# EAGLE design microbit-arduino (EAGLE 9.2.0)
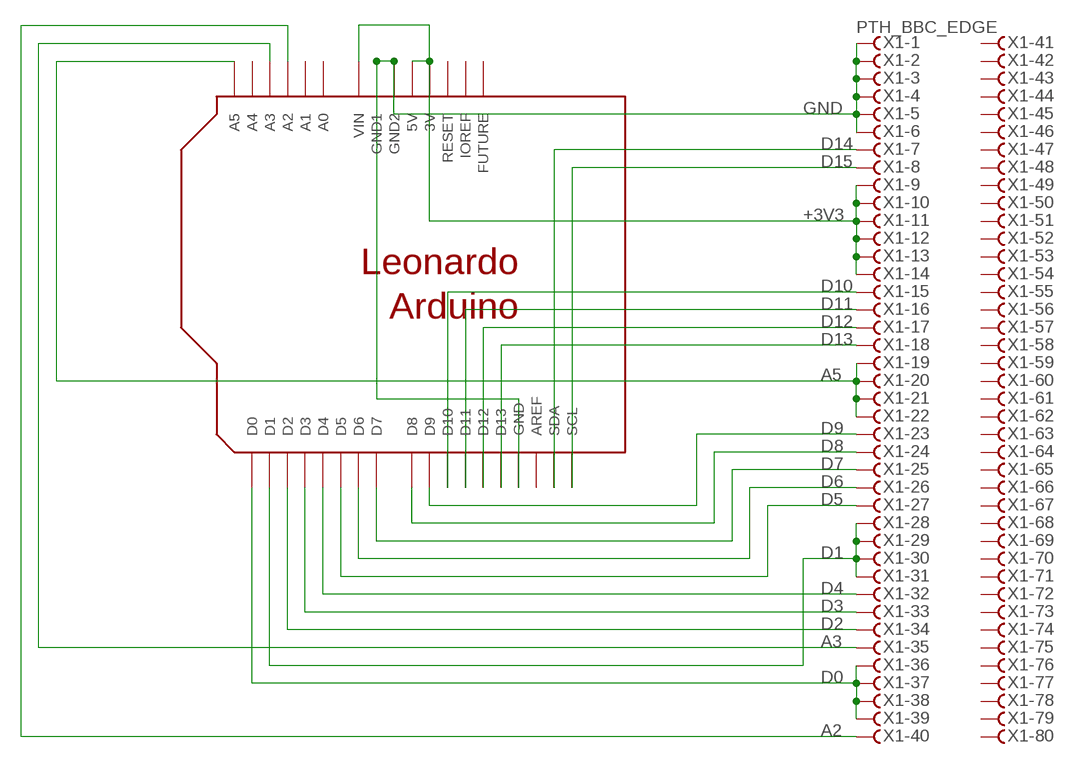
[diagram p0: schematic, sheet 1]

## Parts
U$1  ARDUINO_LEONARDO  [ARDUINO_LEONARDO]
X1  PTH_BBC_EDGE  [PTH_BBC_EDGE]

## Nets
+3V3: U$1.3V U$1.5V U$1.VIN X1.9 X1.10 X1.11 X1.12 X1.13 X1.14
A2: U$1.A2 X1.40
A3: U$1.A3 X1.35
A5: U$1.A5 X1.19 X1.20 X1.21 X1.22
D0: U$1.D0 X1.36 X1.37 X1.38 X1.39
D1: U$1.D1 X1.28 X1.29 X1.30 X1.31
D2: U$1.D2 X1.34
D3: U$1.D3 X1.33
D4: U$1.D4 X1.32
D5: U$1.D5 X1.27
D6: U$1.D6 X1.26
D7: U$1.D7 X1.25
D8: U$1.D8 X1.24
D9: U$1.D9 X1.23
D10: U$1.D10 X1.15
D11: U$1.D11 X1.16
D12: U$1.D12 X1.17
D13: U$1.D13 X1.18
D14: U$1.SDA X1.7
D15: U$1.SCL X1.8
GND: U$1.GND U$1.GND$2(GND2) U$1.GND$3(GND1) X1.1 X1.2 X1.3 X1.4 X1.5 X1.6
Unconnected: U$1.A0 U$1.A1 U$1.A4 U$1.AREF U$1.IOREF U$1.RESERVED(FUTURE) U$1.RESET X1.41 X1.42 X1.43 X1.44 X1.45 X1.46 X1.47 X1.48 X1.49 X1.50 X1.51 X1.52 X1.53 X1.54 X1.55 X1.56 X1.57 X1.58 X1.59 X1.60 X1.61 X1.62 X1.63 X1.64 X1.65 X1.66 X1.67 X1.68 X1.69 X1.70 X1.71 X1.72 X1.73 X1.74 X1.75 X1.76 X1.77 X1.78 X1.79 X1.80

## Library data of the parts
U$1 = srg:ARDUINO_LEONARDO: Arduino Leonardo I2C Pins: D2, D3 PWM Pins: D3, D5, D5, D11, D13 Interrup Pint: D2, D3 http://arduino.cc/en/Main/arduinoBoardLeonardo
X1 = microbit:PTH_BBC_EDGE: TE CONNECTIVITY / AMP - BUCHSE, SCSI, VERTIKAL, 80 Source: Data sheet <http://www.tycoelectronics.com/commerce/DocumentDelivery/DDEController?Action=srchrtrv&DocNm=5749069&DocType=Customer+Drawing&DocLang=English>

## Board
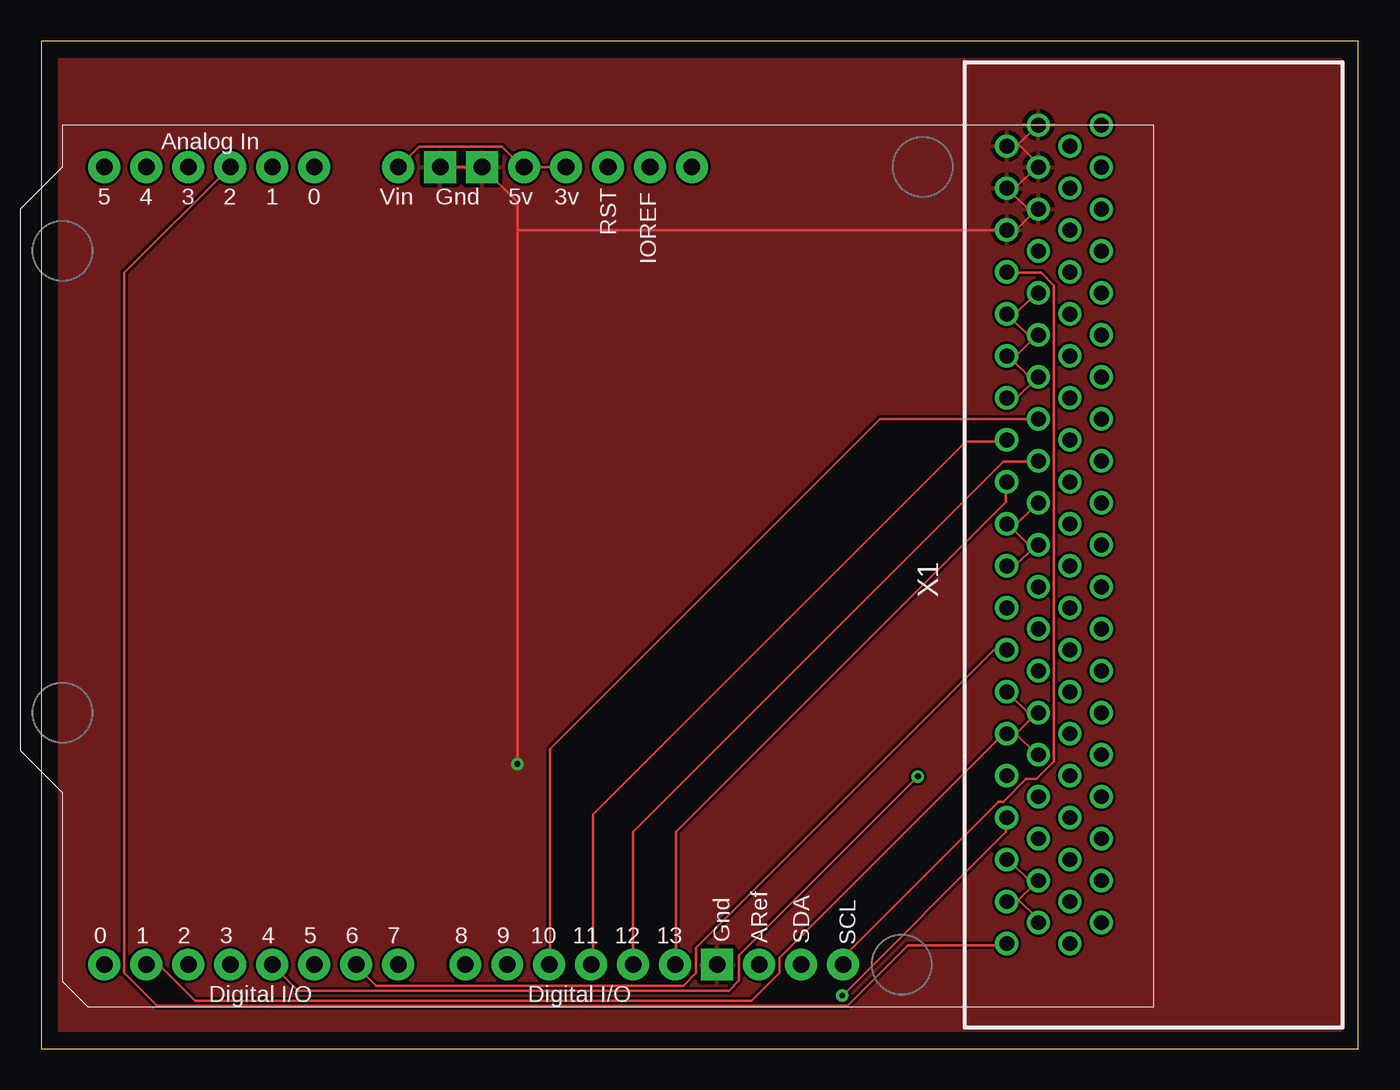
[diagram p1: board, top side]
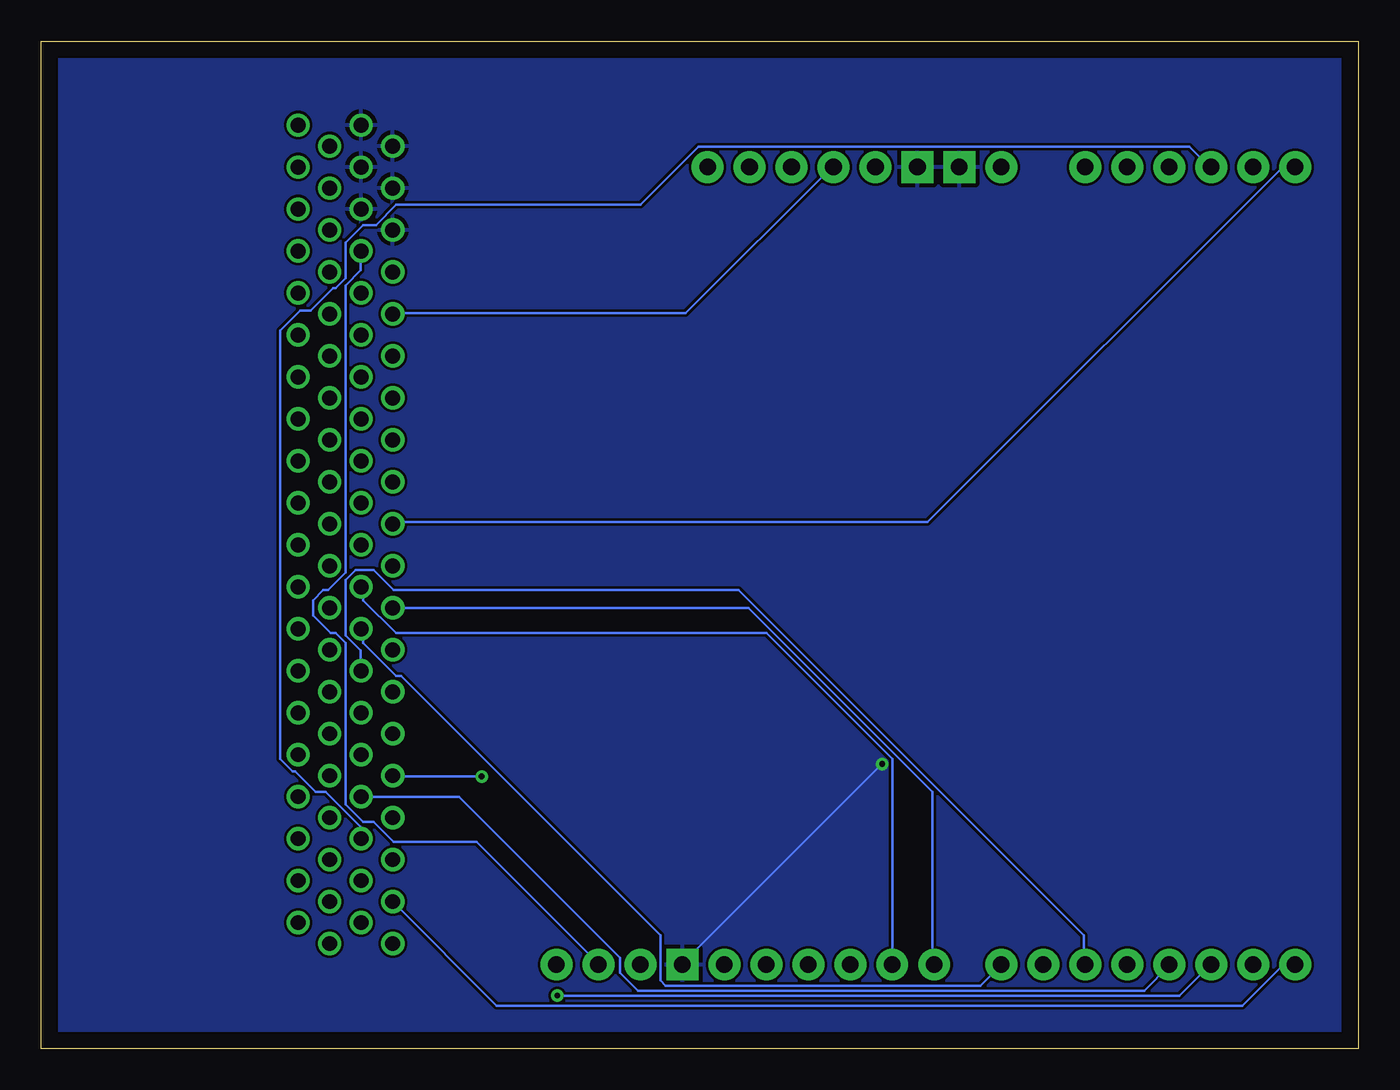
[diagram p2: board, bottom side, seen from below]

Size 79.68 x 60.95 mm. Coordinates in mm from the lower left corner, seen from the top.
Outline: 0,0 79.68,0 79.68,60.95 0,60.95 0,0
Copper layers (1*16): Top 0.035mm / dielectric 1.5mm / Bottom 0.035mm
Design rules "default": minimum track width 6mil, minimum drill 0.35mm, track to track 6mil, track to pad 6mil, pad to pad 6mil, via to via 6mil, smd to smd 6mil, copper to edge 40mil, drill to drill 6mil, minimum pad ring 10mil, minimum via ring 8mil, stop-mask expansion 4mil, vias tented up to drill 0mil, thermal gap 10mil

### Footprints (pad centres in the part's own frame; a part is rotated, then mirrored left to right if it is on the bottom)
ARDUINO_LEONARDO = drill 1 pad 1.93: 3V 1.27,-24.13; 5V 3.81,-24.13; A0 16.51,-24.13; A1 19.05,-24.13; A2 21.59,-24.13; A3 24.13,-24.13; A4 26.67,-24.13; A5 29.21,-24.13; AREF -10.414,24.13; D0 29.21,24.13; D1 26.67,24.13; D2 24.13,24.13; D3 21.59,24.13; D4 19.05,24.13; D5 16.51,24.13; D6 13.97,24.13; D7 11.43,24.13; D8 7.366,24.13; D9 4.826,24.13; D10 2.286,24.13; D11 -0.254,24.13; D12 -2.794,24.13; D13 -5.334,24.13; IOREF -3.81,-24.13; RESERVED -6.35,-24.13; RESET -1.27,-24.13; SCL -15.494,24.13; SDA -12.954,24.13; VIN 11.43,-24.13 | drill 1 pad 1.93 square: GND -7.874,24.13; GND$2 8.89,-24.13; GND$3 6.35,-24.13
PTH_BBC_EDGE = drill 0.9 pad 1.27: 1 49.53,-1.905; 2 48.26,0.005; 3 46.99,-1.905; 4 45.72,0.005; 5 44.45,-1.905; 6 43.18,0.005; 7 41.91,-1.905; 8 40.64,0.005; 9 39.37,-1.905; 10 38.1,0.005; 11 36.83,-1.905; 12 35.56,0.005; 13 34.29,-1.905; 14 33.02,0.005; 15 31.75,-1.905; 16 30.48,0.005; 17 29.21,-1.905; 18 27.94,0.005; 19 26.67,-1.905; 20 25.4,0.005; 21 24.13,-1.905; 22 22.86,0.005; 23 21.59,-1.905; 24 20.32,0.005; 25 19.05,-1.905; 26 17.78,0.005; 27 16.51,-1.905; 28 15.24,0.005; 29 13.97,-1.905; 30 12.7,0.005; 31 11.43,-1.905; 32 10.16,0.005; 33 8.89,-1.905; 34 7.62,0.005; 35 6.35,-1.905; 36 5.08,0.005; 37 3.81,-1.905; 38 2.54,0.005; 39 1.27,-1.905; 40 0,0.005; 41 49.53,-5.724; 42 48.26,-3.814; 43 46.99,-5.724; 44 45.72,-3.814; 45 44.45,-5.724; 46 43.18,-3.814; 47 41.91,-5.724; 48 40.64,-3.814; 49 39.37,-5.724; 50 38.1,-3.814; 51 36.83,-5.724; 52 35.56,-3.814; 53 34.29,-5.724; 54 33.02,-3.814; 55 31.75,-5.724; 56 30.48,-3.814; 57 29.21,-5.724; 58 27.94,-3.814; 59 26.67,-5.724; 60 25.4,-3.814; 61 24.13,-5.724; 62 22.86,-3.814; 63 21.59,-5.724; 64 20.32,-3.814; 65 19.05,-5.724; 66 17.78,-3.814; 67 16.51,-5.724; 68 15.24,-3.814; 69 13.97,-5.724; 70 12.7,-3.814; 71 11.43,-5.724; 72 10.16,-3.814; 73 8.89,-5.724; 74 7.62,-3.814; 75 6.35,-5.724; 76 5.08,-3.814; 77 3.81,-5.724; 78 2.54,-3.814; 79 1.27,-5.724; 80 0,-3.814

### Placement (x,y rotation side)
U$1  33.02,29.21 180 top
X1  58.42,6.35 90 top

### Tracks (layer width: path | path; a pad name or v marks a point on that pad's centre or on a via)
+3V3
  Top 0.152: 60.05,40.39 60.2,40.54 X1.13 60.05,40.39 | 60.05,40.39 59.13,39.47 58.52,39.47 X1.14 | 60.05,40.39 58.67,41.76 | 58.67,41.76 58.52,41.91 X1.12 58.67,41.76 | 60.05,42.98 58.83,41.76 58.67,41.76 | 60.05,42.98 60.2,43.13 X1.11 60.05,42.98 | 58.67,44.2 59.89,42.98 60.05,42.98 | 58.67,44.2 58.52,44.35 X1.10 58.67,44.2 | 58.67,44.2 60.2,45.72 X1.9 | U$1.VIN 21.64,53.34 22.86,54.56 27.89,54.56 29.11,53.34 U$1.5V U$1.3V
  Bottom 0.152: X1.10 58.37,44.5 40.69,44.5 31.85,53.34 U$1.3V
A2
  Top 0.152: U$1.A2 5.03,46.94 5.03,4.57 7.01,2.59 48.77,2.59 52.43,6.25 58.37,6.25 X1.40
A3
  Bottom 0.152: X1.35 60.35,12.8 60.35,13.41 62.48,15.54 63.09,15.54 64.31,16.76 64.47,16.76 65.23,17.53 65.23,43.43 64.01,44.65 63.4,44.65 62.03,46.02 61.87,46.02 61.27,46.63 61.27,48.77 60.2,49.84 59.44,49.84 58.22,51.05 43.43,51.05 39.93,54.56 10.21,54.56 8.99,53.34 U$1.A3
A5
  Top 0.152: 60.05,30.33 60.2,30.48 X1.21 60.05,30.33 | 60.05,30.33 58.98,29.26 58.52,29.26 X1.22 | 58.67,31.55 59.89,30.33 60.05,30.33 | 58.67,31.55 58.52,31.7 X1.20 58.67,31.55 | 58.67,31.55 58.83,31.55 60.2,32.92 X1.19
  Bottom 0.152: U$1.A5 4.57,53.34 26.06,31.85 58.37,31.85 X1.20
D0
  Top 0.152: 59.13,8.99 58.52,8.99 X1.38 | 60.05,9.91 60.2,10.06 X1.37 60.05,9.91 | 60.05,9.91 59.13,8.99 | 59.13,8.99 60.2,7.92 60.2,7.62 X1.39 | 60.05,9.91 58.52,11.43 X1.36
  Bottom 0.152: U$1.D0 3.81,5.03 4.57,5.03 7.01,2.59 52.12,2.59 58.37,8.84 X1.38
D1
  Top 0.152: 58.98,19.05 X1.30 | 60.05,20.12 60.2,20.27 X1.29 60.05,20.12 | 60.05,20.12 58.98,19.05 | 60.05,20.12 59.89,20.12 58.52,21.49 X1.28 | 58.98,19.05 60.2,17.83 X1.31 | 58.52,19.05 X1.30 | X1.30 58.22,19.05 44.65,5.49 44.65,4.57 42.98,2.9 9.3,2.9 7.16,5.03 6.4,5.03 U$1.D1
D2  (via drill 0.35)
  Top 0.152: v48.46,3.2 58.37,13.11 58.37,13.87 X1.34
  Bottom 0.152: v48.46,3.2 10.82,3.2 8.99,5.03 U$1.D2
D3
  Bottom 0.152: X1.33 54.41,15.24 44.65,5.49 44.65,4.57 43.59,3.5 12.95,3.5 11.43,5.03 U$1.D3
D4  (via drill 0.35)
  Top 0.152: v53.03,16.46 42.22,5.64 42.22,4.12 41.6,3.5 15.54,3.5 U$1.D4
  Bottom 0.152: v53.03,16.46 58.37,16.46 X1.32
D5
  Bottom 0.152: X1.27 60.35,22.86 60.35,24.08 61.27,24.99 61.27,28.35 60.66,28.96 59.59,28.96 58.37,27.74 37.49,27.74 16.61,6.86 16.61,5.18 U$1.D5
D6
  Top 0.152: X1.26 58.37,24.08 57.61,24.08 39.62,6.1 39.62,4.57 38.86,3.81 20.27,3.81 19.05,5.03 U$1.D6
D7
  Bottom 0.152: U$1.D7 22.86,3.81 41.91,3.81 42.22,4.12 42.22,6.86 57.91,22.55 58.22,22.55 60.2,24.54 60.2,25.3 X1.25
D8
  Bottom 0.152: X1.24 36.88,26.67 25.76,15.54 25.76,5.18 U$1.D8
D9
  Bottom 0.152: U$1.D9 28.19,17.53 35.81,25.15 58.22,25.15 60.2,27.13 60.2,27.89 X1.23
D10
  Top 0.152: X1.15 50.75,38.1 30.79,18.14 30.79,5.18 U$1.D10
D11
  Top 0.152: X1.16 58.37,36.73 55.93,36.73 33.38,14.17 33.38,5.18 U$1.D11
D12
  Top 0.152: U$1.D12 35.81,13.11 58.22,35.51 60.2,35.51 X1.17
D13
  Top 0.152: X1.18 58.37,34.29 58.37,33.07 38.41,13.11 38.41,5.18 U$1.D13
D14
  Bottom 0.152: X1.7 60.35,48.16 60.35,47.09 61.27,46.18 61.27,28.8 62.33,27.74 62.64,27.74 63.25,27.13 63.25,26.21 62.18,25.15 61.87,25.15 61.27,24.54 61.27,14.78 60.2,13.72 59.59,13.72 58.37,12.5 53.34,12.5 46.02,5.18 U$1.SDA
D15
  Top 0.152: X1.8 58.52,46.94 60.5,46.94 61.27,46.18 61.27,17.37 60.2,16.31 59.59,16.31 58.22,14.94 57.91,14.94 48.62,5.64 48.62,5.18 U$1.SCL
GND  (via drill 0.35)
  Top 0.152: 60.05,50.6 60.2,50.75 X1.5 60.05,50.6 | 60.05,50.6 58.98,49.53 X1.6 28.8,49.53 | 58.67,51.82 59.89,50.6 60.05,50.6 | 58.67,51.82 58.52,51.97 X1.4 58.67,51.82 | 59.13,54.71 58.52,54.71 X1.2 | 59.13,54.71 60.2,55.78 X1.1 | 60.2,53.34 60.2,53.65 59.13,54.71 | 60.2,53.34 58.67,51.82 | 60.2,53.34 X1.3 | U$1.GND$2 U$1.GND$3 28.8,51.21 28.8,49.53 | 28.8,49.53 v28.8,17.22
  Bottom 0.152: v28.8,17.22 40.84,5.18 U$1.GND
  pour Top: -1.27,62.23 -1.27,0 81.28,0 81.28,62.23
  pour Bottom: 0,60.96 0,0 80.01,0 80.01,60.96